# Altium project minna_pcb_project.PrjPCB
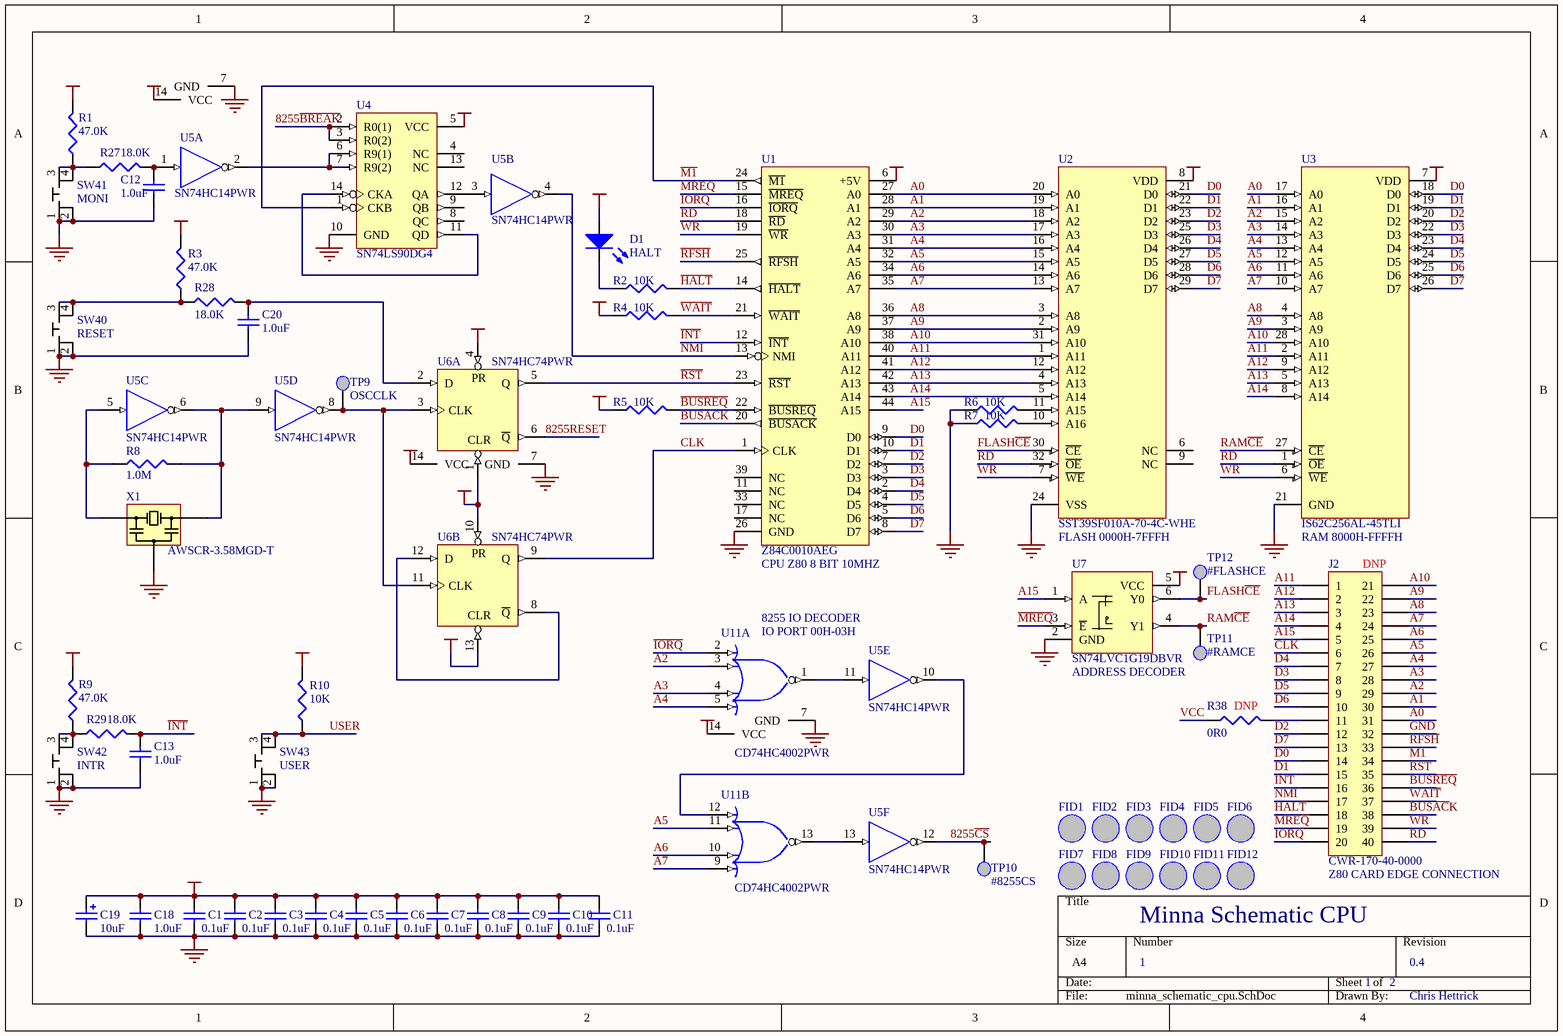
[diagram p0: minna_schematic_cpu.SchDoc]
ProjectTitle: smari minna; ProjectRevision: v0.4; ProjectAuthor: Chris Hettrick; CompanyName: Populate All The Resistors; CompanyEmail: info@populatealltheresistors.com
2 sheets, 145 parts. Net scope: global (net labels, ports and power ports of the same name join across sheets).
Board file: minna_pcb.PcbDoc
Sheets:
  minna_schematic_cpu.SchDoc
  minna_schematic_io.SchDoc

## Sheet minna_schematic_cpu.SchDoc: Minna Schematic CPU
size A4; Author: Chris Hettrick; CompanyName: Populate All The Resistors; DrawnBy: Chris Hettrick; Engineer: Chris Hettrick; Organization: Populate All The Resistors; DocumentNumber: 1; Revision: 0.4; SheetNumber: 1; SheetTotal: 2; DocumentName: minna_schematic_cpu.SchDoc; ProjectName: smari

### Parts
C1  0.1uF  [0603]
C2  0.1uF  [0603]
C3  0.1uF  [0603]
C4  0.1uF  [0603]
C5  0.1uF  [0603]
C6  0.1uF  [0603]
C7  0.1uF  [0603]
C8  0.1uF  [0603]
C9  0.1uF  [0603]
C10  0.1uF  [0603]
C11  0.1uF  [0603]
C12  1.0uF  [0805]
C13  1.0uF  [0805]
C18  1.0uF  [0805]
C19  10uF  [T491A]
C20  1.0uF  [0805]
D1  HALT  [APG1608]
FID1  FIDUCIAL  [Fiducial]  (value not drawn)  (no BOM)
FID2  FIDUCIAL  [Fiducial]  (value not drawn)  (no BOM)
FID3  FIDUCIAL  [Fiducial]  (value not drawn)  (no BOM)
FID4  FIDUCIAL  [Fiducial]  (value not drawn)  (no BOM)
FID5  FIDUCIAL  [Fiducial]  (value not drawn)  (no BOM)
FID6  FIDUCIAL  [Fiducial]  (value not drawn)  (no BOM)
FID7  FIDUCIAL  [Fiducial]  (value not drawn)  (no BOM)
FID8  FIDUCIAL  [Fiducial]  (value not drawn)  (no BOM)
FID9  FIDUCIAL  [Fiducial]  (value not drawn)  (no BOM)
FID10  FIDUCIAL  [Fiducial]  (value not drawn)  (no BOM)
FID11  FIDUCIAL  [Fiducial]  (value not drawn)  (no BOM)
FID12  FIDUCIAL  [Fiducial]  (value not drawn)  (no BOM)
J2  CWR-170-40-0000  Load: DNP  Notes: Z80 CARD EDGE CONNECTION  [CARD EDGE 40 PIN]
R1  47.0K  [0603]
R2  10K  [0603]
R3  47.0K  [0603]
R4  10K  [0603]
R5  10K  [0603]
R6  10K  [0603]
R7  10K  [0603]
R8  1.0M  [0603]
R9  47.0K  [0603]
R10  10K  [0603]
R27  18.0K  [0603]
R28  18.0K  [0603]
R29  18.0K  [0603]
R38  0R0  Load: DNP  [0603]
SW40  RESET  [PTS645SM43SMTR LFS]
SW41  MONI  [PTS645SM43SMTR LFS]
SW42  INTR  [PTS645SM43SMTR LFS]
SW43  USER  [PTS645SM43SMTR LFS]
TP9  OSCCLK  [TP_ICT]  (no BOM)
TP10  #8255CS  [TP_ICT]  (no BOM)
TP11  #RAMCE  [TP_ICT]  (no BOM)
TP12  #FLASHCE  [TP_ICT]  (no BOM)
U1  Z84C0010AEG  Notes: CPU Z80 8 BIT 10MHZ  [LQFP-44]
U2  SST39SF010A-70-4C-WHE  Notes: FLASH 0000H-7FFFH  [SST39SF010A-70-4C-WHE]
U3  IS62C256AL-45TLI  Notes: RAM 8000H-FFFFH  [IS62C256AL-45TLI]
U4  SN74LS90DG4  [DO14]
U5  SN74HC14PWR  [PW014]  (parts A,B,C,D,E,F of 6)
U6  SN74HC74PWR  [PW014]  (parts A,B of 2)
U7  SN74LVC1G19DBVR  Notes: ADDRESS DECODER  [SOT-23-6 DBV R-PDSO-G6]
U11  CD74HC4002PWR  [PW014]  (parts A,B of 2)
X1  AWSCR-3.58MGD-T  [AWSCR-MG]

### Nets
GND: C1.1 C2.1 C3.1 C4.1 C5.1 C6.1 C7.1 C8.1 C9.1 C10.1 C11.1 C12.1 C13.1 C18.2 C19.2 C20.1 J2.32 R6.1 R7.1 SW40.1 SW40.2 SW41.1 SW41.2 SW42.1 SW42.2 SW43.1 SW43.2 U1.26(GND) U2.24(VSS) U3.21(GND) U4.10(GND) U5.7(GND) U6.7(GND) U7.2(GND) U11.7(GND) X1.2
VCC: C1.2 C2.2 C3.2 C4.2 C5.2 C6.2 C7.2 C8.2 C9.2 C10.2 C11.2 C18.1 C19.1 D1.1(A) R1.2 R3.2 R4.1 R5.1 R9.2 R10.2 R38.1 U1.6(+5V) U2.8(VDD) U3.7(VDD) U4.5(VCC) U5.14(VCC) U6.1(CLR) U6.4(PR) U6.10(PR) U6.13(CLR) U6.14(VCC) U7.5(VCC) U11.14(VCC)
8255~{BREAK}: U4.2(R0(1)) U4.3(R0(2))
8255~{CS}: TP10.TP U5.12(~{Y})
8255RESET: U6.6(~{Q})
A0: J2.31 U1.27(A0) U2.20(A0) U3.17(A0)
A1: J2.30 U1.28(A1) U2.19(A1) U3.16(A1)
A2: J2.29 U1.29(A2) U2.18(A2) U3.15(A2) U11.3(B)
A3: J2.28 U1.30(A3) U2.17(A3) U3.14(A3) U11.4(C)
A4: J2.27 U1.31(A4) U2.16(A4) U3.13(A4) U11.5(D)
A5: J2.26 U1.32(A5) U2.15(A5) U3.12(A5) U11.11(B)
A6: J2.25 U1.34(A6) U2.14(A6) U3.11(A6) U11.10(C)
A7: J2.24 U1.35(A7) U2.13(A7) U3.10(A7) U11.9(D)
A8: J2.23 U1.36(A8) U2.3(A8) U3.4(A8)
A9: J2.22 U1.37(A9) U2.2(A9) U3.3(A9)
A10: J2.21 U1.38(A10) U2.31(A10) U3.28(A10)
A11: J2.1 U1.40(A11) U2.1(A11) U3.2(A11)
A12: J2.2 U1.41(A12) U2.12(A12) U3.9(A12)
A13: J2.3 U1.42(A13) U2.4(A13) U3.5(A13)
A14: J2.4 U1.43(A14) U2.5(A14) U3.8(A14)
A15: J2.5 U1.44(A15) U7.1(A)
~{BUSAC}K: J2.38 U1.20(~{BUSACK})
~{BUSREQ}: J2.36 R5.2 U1.22(~{BUSREQ})
CLK: J2.6 U1.1(CLK) U6.9(Q)
D0: J2.14 U1.9(D0) U2.21(D0) U3.18(D0)
D1: J2.15 U1.10(D1) U2.22(D1) U3.19(D1)
D2: J2.12 U1.7(D2) U2.23(D2) U3.20(D2)
D3: J2.8 U1.3(D3) U2.25(D3) U3.22(D3)
D4: J2.7 U1.2(D4) U2.26(D4) U3.23(D4)
D5: J2.9 U1.4(D5) U2.27(D5) U3.24(D5)
D6: J2.10 U1.5(D6) U2.28(D6) U3.25(D6)
D7: J2.13 U1.8(D7) U2.29(D7) U3.26(D7)
FLASH~{CE}: TP12.TP U2.30(~{CE}) U7.6(Y0)
~{HALT}: J2.18 R2.2 U1.14(~{HALT})
~{INT}: C13.2 J2.16 R29.2 U1.12(~{INT})
~{IORQ}: J2.20 U1.16(~{IORQ}) U11.2(A)
~{M1}: J2.34 U1.24(~{M1}) U4.1(CKB)
~{MREQ}: J2.19 U1.15(~{MREQ}) U7.3(~{E})
NMI: J2.17 U1.13(NMI) U5.4(~{Y})
~{RD}: J2.40 U1.18(~{RD}) U2.32(~{OE}) U3.1(~{OE})
~{RFSH}: J2.33 U1.25(~{RFSH})
~{RST}: J2.35 U1.23(~{RST}) U6.5(Q)
RAM~{CE}: TP11.TP U3.27(~{CE}) U7.4(Y1)
USER: R10.1 SW43.3 SW43.4
~{WAIT}: J2.37 R4.2 U1.21(~{WAIT})
~{WR}: J2.39 U1.19(~{WR}) U2.7(~{WE}) U3.6(~{WE})
NetC12_2: C12.2 R27.2 U5.1(A)
NetC20_2: C20.2 R28.2 U6.2(D)
NetD1_2: D1.2(K) R2.1
NetJ2_11: J2.11 R38.2
NetR1_1: R1.1 R27.1 SW41.3 SW41.4
NetR3_1: R3.1 R28.1 SW40.3 SW40.4
NetR6_2: R6.2 U2.11(A15)
NetR7_2: R7.2 U2.10(A16)
NetR8_1: R8.1 U5.5(A) X1.3
NetR8_2: R8.2 U5.6(~{Y}) U5.9(A) X1.1
NetR9_1: R9.1 R29.1 SW42.3 SW42.4
NetTP9_TP: TP9.TP U5.8(~{Y}) U6.3(CLK) U6.11(CLK)
NetU4_6: U4.6(R9(1)) U4.7(R9(2)) U5.2(~{Y})
NetU4_11: U4.11(QD) U4.14(CKA)
NetU4_12: U4.12(QA) U5.3(A)
NetU5_10: U5.10(~{Y}) U11.12(A)
NetU5_11: U5.11(A) U11.1(Y)
NetU5_13: U5.13(A) U11.13(Y)
NetU6_8: U6.8(~{Q}) U6.12(D)

Not connected (* = marked no-connect by the designer): U1 11(NC) 17(NC) 33(NC) 39(NC); U2 6(NC) 9(NC); U4 4(NC) 8(QC) 9(QB) 13(NC)

### Notes on the sheet
- (near U11) 8255 IO DECODER
- (near U11) IO PORT 00H-03H
- Title
- Size:
- Date:
- A4
- Number:
- Time:
- Revision:
- Sheet
- of
- File:

### Library data of the parts
C1-C11 = C0603: CAP .10UF 16V CERAMIC X7R 0603; Dist: Digikey; DistPN: 399-1096-1-ND; Load: yes; Mfgr: Kemet; MfgrPN: C0603C104K4RACTU; Polarized: no; Value: 0.1uF; Notes: *; Package: 0603
C12 C13 C18 C20 = C0805: CAP 1.0UF 16V CERAMIC X7R 0805; Dist: Digikey; DistPN: 399-1284-1-ND; Load: yes; Mfgr: Kemet; MfgrPN: C0805C105K4RACTU; Polarized: no; Value: 1.0uF; Package: 0805
  C13 C18: Notes: *
C19 = T491A: CAPACITOR TANT 10UF 10V 10% SMD; Dist: Digikey; DistPN: 399-3684-1-ND; Load: yes; Mfgr: Kemet; MfgrPN: T491A106K010AT; Value: 10uF; Notes: *; Package: 1206; Polarized: yes
D1 = LTST-C190KRKT: LED SUPER RED CLEAR 0603 SMD; Dist: Digikey; DistPN: 160-1436-2-ND; Load: yes; Mfgr: Lite-On; MfgrPN: LTST-C190KRKT; Package: 0603; Polarized: yes; Value: HALT
FID1-FID12 = FIDUCIAL: Load: DNP; Polarized: no; Dist: *; DistPN: *; Mfgr: *; MfgrPN: *; Notes: *; Value: FIDUCIAL; Package: *
J2 = CWR-170-40-0000: CONN CARD EDGE 40PIN GOLD; Dist: Digikey; DistPN: CCE40G-ND; Mfgr: CW Industries; Polarized: yes; MfgrPN: CWR-170-40-0000; Package: *; Value: CWR-170-40-0000
R1 R3 R9 = MCR03EZPFX: RES 47.0K OHM 1/10W 1% 0603 SMD; Dist: Digikey; DistPN: P47.0KHCT-ND; Mfgr: Panasonic; MfgrPN: ERJ-3EKF4702V; Load: yes; Polarized: no; Value: 47.0K; Package: 0603
R2 R4-R7 R10 = MCR03EZPFX: RES 10.0K OHM 1/10W 1% 0603 SMD; Dist: Digikey; DistPN: P10.0KHCT-ND; Mfgr: Panasonic; MfgrPN: ERJ-3EKF1002V; Load: yes; Polarized: no; Value: 10K; Package: 0603
R8 = MCR03EZPFX: RES 1.00M OHM 1/10W 1% 0603 SMD; Dist: Digikey; DistPN: P1.00MHCT-ND; Mfgr: Panasonic; MfgrPN: ERJ-3EKF1004V; Load: yes; Polarized: no; Value: 1.0M; Package: 0603
R27-R29 = MCR03EZPFX: RES 18.0K OHM 1/10W 1% 0603 SMD; Dist: Digikey; DistPN: P18.0KHCT-ND; Mfgr: Panasonic; MfgrPN: ERJ-3EKF1802V; Load: yes; Polarized: no; Value: 18.0K; Package: 0603
R38 = ERJ-3EKF1002V: RES 0.0 OHM 1/10W 0603 SMD; Dist: Digikey; DistPN: P0.0GCT-ND; Mfgr: Panasonic; MfgrPN: ERJ-3GEY0R00V; Notes: jumper; Polarized: no; Value: 0R0; Package: 0603
SW40-SW43 = PTS645SM43SMTR LFS: SWITCH TACT 6MM 160GF H=4.3MM; Dist: Digikey; DistPN: CKN9112CT-ND; Load: yes; Mfgr: C&K Components; MfgrPN: PTS645SM43SMTR LFS; Package: SMD-6x6; Polarized: yes
  SW40: Value: RESET
  SW41: Value: MONI
  SW42: Value: INTR
  SW43: Value: USER
TP9-TP12 = TP_ICT: TEST POINT; Load: DNP; Polarized: no
  TP9: Value: OSCCLK
  TP10: Value: #8255CS
  TP11: Value: #RAMCE
  TP12: Value: #FLASHCE
U1 = Z84C0010AEG: IC Z80 CPU CMOS 10MHZ 44LQFP; Dist: Digikey; DistPN: 269-4574-ND; Load: yes; Mfgr: Zilog; MfgrPN: Z84C0010AEG; Package: LQFP-44; Polarized: yes; Value: Z84C0010AEG
U2 = SST39SF010A-70-4C-WHE: IC FLASH MPF 1MBIT 70NS 32TSOP; Dist: Digikey; DistPN: SST39SF010A-70-4C-WHE-ND; Load: yes; Mfgr: SST; MfgrPN: SST39SF010A-70-4C-WHE; Package: TSOP-32; Polarized: yes; Value: SST39SF010A-70-4C-WHE
U3 = IS62C256AL-45TLI: IC SRAM 256KBIT 45NS 28TSOP; Dist: Digikey; DistPN: 706-1109-ND; Load: yes; Mfgr: ISSI; MfgrPN: IS62C256AL-45TLI; Package: TSOP-28; Polarized: yes; Value: IS62C256AL-45TLI
U4 = SN74LS90DG4: IC COUNTER DECADE 4BIT 14SOIC; Dist: Digikey; DistPN: 296-3746-5-ND; Load: yes; Mfgr: Texas Instruments; MfgrPN: SN74LS90DG4; Package: SOIC-14; Polarized: yes; Value: SN74LS90DG4
U5 = SN74HC14PWR: IC HEX SCHMITT-TRIG INV 14-TSSOP; Dist: Digikey; DistPN: 296-8234-1-ND; Load: yes; Mfgr: Texas Instruments; MfgrPN: SN74HC14PWR; Package: TSSOP-14; Polarized: yes; Value: SN74HC14PWR
U6 = SN74HC74PWR: IC DUAL F-F W/CLR/PRESET 14TSSOP; Dist: Digikey; DistPN: 296-8372-1-ND; Load: yes; Mfgr: Texas Instruments; MfgrPN: SN74HC74PWR; Package: TSSOP-14; Polarized: yes; Value: SN74HC74PWR
U7 = SN74LVC1G19DBVR: IC MUX/DECODER SNGL 1OF2 SOT23-6; Dist: Digikey; DistPN: 296-16982-1-ND; Load: yes; Mfgr: Texas Instruments; MfgrPN: SN74LVC1G19DBVR; Package: TSSOP-6; Polarized: yes; Value: SN74LVC1G19DBVR
U11 = CD74HC4002PWR: IC DUAL 4-IN NOR GATE 14TSSOP; Dist: Digikey; DistPN: 296-31585-1-ND; Load: yes; Mfgr: Texas Instruments; MfgrPN: CD74HC4002PWR; Notes: *; Package: TSSOP-14; Polarized: yes; Value: CD74HC4002PWR
X1 = AWSCR-3.58MGD-T: RESONATOR CER 3.58MHZ W/CAP SMD; Dist: Digikey; DistPN: 535-9365-1-ND; Load: yes; Mfgr: Abracon; Polarized: no; Value: AWSCR-3.58MGD-T; MfgrPN: AWSCR-3.58MGD-T; Package: SMD-7.4x3.4

## Sheet minna_schematic_io.SchDoc: Minna Schematic Input Output
size A4; Author: Chris Hettrick; CompanyName: Populate All The Resistors; DrawnBy: Chris Hettrick; Engineer: Chris Hettrick; Organization: Populate All The Resistors; DocumentNumber: 2; Revision: 0.4; SheetNumber: 2; SheetTotal: 2; DocumentName: minna_schematic_io.SchDoc; ProjectName: smari
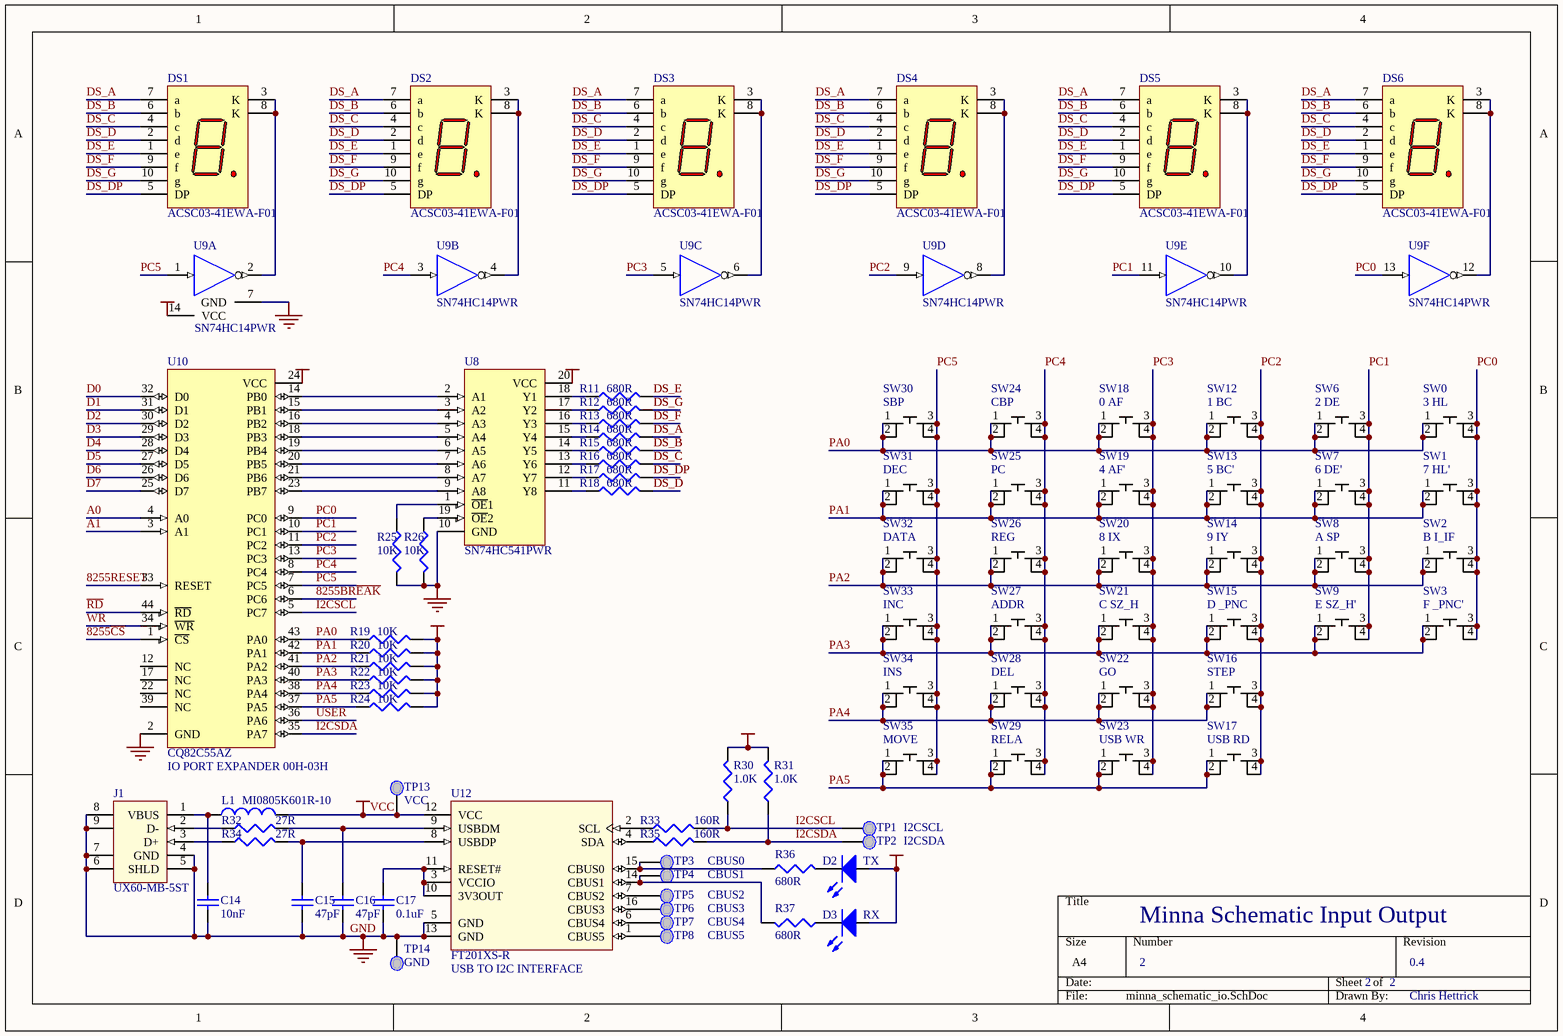
[diagram p1: minna_schematic_io.SchDoc]

### Parts
C14  10nF  [0603]
C15  47pF  [0603]
C16  47pF  [0603]
C17  0.1uF  [0603]
D2  TX  [APG1608]
D3  RX  [APG1608]
DS1  ACSC03-41EWA-F01  [ACSC03-41EWA-F01]
DS2  ACSC03-41EWA-F01  [ACSC03-41EWA-F01]
DS3  ACSC03-41EWA-F01  [ACSC03-41EWA-F01]
DS4  ACSC03-41EWA-F01  [ACSC03-41EWA-F01]
DS5  ACSC03-41EWA-F01  [ACSC03-41EWA-F01]
DS6  ACSC03-41EWA-F01  [ACSC03-41EWA-F01]
J1  UX60-MB-5ST  [UX60-MB-5ST]
L1  MI0805K601R-10  [0805]
R11  680R  [0603]
R12  680R  [0603]
R13  680R  [0603]
R14  680R  [0603]
R15  680R  [0603]
R16  680R  [0603]
R17  680R  [0603]
R18  680R  [0603]
R19  10K  [0603]
R20  10K  [0603]
R21  10K  [0603]
R22  10K  [0603]
R23  10K  [0603]
R24  10K  [0603]
R25  10K  [0603]
R26  10K  [0603]
R30  1.0K  [0603]
R31  1.0K  [0603]
R32  27R  [0603]
R33  160R  [0603]
R34  27R  [0603]
R35  160R  [0603]
R36  680R  [0603]
R37  680R  [0603]
SW0  3 HL  [PTS645SM43SMTR LFS]
SW1  7 HL'  [PTS645SM43SMTR LFS]
SW2  B I_IF  [PTS645SM43SMTR LFS]
SW3  F _PNC'  [PTS645SM43SMTR LFS]
SW6  2 DE  [PTS645SM43SMTR LFS]
SW7  6 DE'  [PTS645SM43SMTR LFS]
SW8  A SP  [PTS645SM43SMTR LFS]
SW9  E SZ_H'  [PTS645SM43SMTR LFS]
SW12  1 BC  [PTS645SM43SMTR LFS]
SW13  5 BC'  [PTS645SM43SMTR LFS]
SW14  9 IY  [PTS645SM43SMTR LFS]
SW15  D _PNC  [PTS645SM43SMTR LFS]
SW16  STEP  [PTS645SM43SMTR LFS]
SW17  USB RD  [PTS645SM43SMTR LFS]
SW18  0 AF  [PTS645SM43SMTR LFS]
SW19  4 AF'  [PTS645SM43SMTR LFS]
SW20  8 IX  [PTS645SM43SMTR LFS]
SW21  C SZ_H  [PTS645SM43SMTR LFS]
SW22  GO  [PTS645SM43SMTR LFS]
SW23  USB WR  [PTS645SM43SMTR LFS]
SW24  CBP  [PTS645SM43SMTR LFS]
SW25  PC  [PTS645SM43SMTR LFS]
SW26  REG  [PTS645SM43SMTR LFS]
SW27  ADDR  [PTS645SM43SMTR LFS]
SW28  DEL  [PTS645SM43SMTR LFS]
SW29  RELA  [PTS645SM43SMTR LFS]
SW30  SBP  [PTS645SM43SMTR LFS]
SW31  DEC  [PTS645SM43SMTR LFS]
SW32  DATA  [PTS645SM43SMTR LFS]
SW33  INC  [PTS645SM43SMTR LFS]
SW34  INS  [PTS645SM43SMTR LFS]
SW35  MOVE  [PTS645SM43SMTR LFS]
TP1  I2CSCL  [TP_ICT]  (no BOM)
TP2  I2CSDA  [TP_ICT]  (no BOM)
TP3  CBUS0  [TP_ICT]  (no BOM)
TP4  CBUS1  [TP_ICT]  (no BOM)
TP5  CBUS2  [TP_ICT]  (no BOM)
TP6  CBUS3  [TP_ICT]  (no BOM)
TP7  CBUS4  [TP_ICT]  (no BOM)
TP8  CBUS5  [TP_ICT]  (no BOM)
TP13  VCC  [TP_ICT]  (no BOM)
TP14  GND  [TP_ICT]  (no BOM)
U8  SN74HC541PWR  [PW020]
U9  SN74HC14PWR  [PW014]  (parts A,B,C,D,E,F of 6)
U10  CQ82C55AZ  Notes: IO PORT EXPANDER 00H-03H  [MQFP-44]
U12  FT201XS-R  Notes: USB TO I2C INTERFACE  [SSOP-16]

### Nets
GND: C14.2 C15.2 C16.2 C17.1 J1.4(GND) J1.5(SHLD) J1.6(SHLD) J1.7(SHLD) J1.8(SHLD) J1.9(SHLD) R25.2 R26.2 TP14.TP U8.10(GND) U9.7(GND) U10.2(GND) U12.5(GND) U12.13(GND)
VCC: D2.1(A) D3.1(A) L1.2 R19.2 R20.2 R21.2 R22.2 R23.2 R24.2 R30.2 R31.2 TP13.TP U8.20(VCC) U9.14(VCC) U10.24(VCC) U12.12(VCC)
8255~{BREAK}: U10.6(PC6)
8255~{CS}: U10.1(~{CS})
8255RESET: U10.33(RESET)
A0: U10.4(A0)
A1: U10.3(A1)
D0: U10.32(D0)
D1: U10.31(D1)
D2: U10.30(D2)
D3: U10.29(D3)
D4: U10.28(D4)
D5: U10.27(D5)
D6: U10.26(D6)
D7: U10.25(D7)
DS_A: DS1.7(a) DS2.7(a) DS3.7(a) DS4.7(a) DS5.7(a) DS6.7(a) R14.2
DS_B: DS1.6(b) DS2.6(b) DS3.6(b) DS4.6(b) DS5.6(b) DS6.6(b) R15.2
DS_C: DS1.4(c) DS2.4(c) DS3.4(c) DS4.4(c) DS5.4(c) DS6.4(c) R16.2
DS_D: DS1.2(d) DS2.2(d) DS3.2(d) DS4.2(d) DS5.2(d) DS6.2(d) R18.2
DS_DP: DS1.5(DP) DS2.5(DP) DS3.5(DP) DS4.5(DP) DS5.5(DP) DS6.5(DP) R17.2
DS_E: DS1.1(e) DS2.1(e) DS3.1(e) DS4.1(e) DS5.1(e) DS6.1(e) R11.2
DS_F: DS1.9(f) DS2.9(f) DS3.9(f) DS4.9(f) DS5.9(f) DS6.9(f) R13.2
DS_G: DS1.10(g) DS2.10(g) DS3.10(g) DS4.10(g) DS5.10(g) DS6.10(g) R12.2
I2CSCL: R30.1 R33.2 TP1.TP U10.5(PC7)
I2CSDA: R31.1 R35.2 TP2.TP U10.35(PA7)
PA0: R19.1 SW0.1 SW0.2 SW6.1 SW6.2 SW12.1 SW12.2 SW18.1 SW18.2 SW24.1 SW24.2 SW30.1 SW30.2 U10.43(PA0)
PA1: R20.1 SW1.1 SW1.2 SW7.1 SW7.2 SW13.1 SW13.2 SW19.1 SW19.2 SW25.1 SW25.2 SW31.1 SW31.2 U10.42(PA1)
PA2: R21.1 SW2.1 SW2.2 SW8.1 SW8.2 SW14.1 SW14.2 SW20.1 SW20.2 SW26.1 SW26.2 SW32.1 SW32.2 U10.41(PA2)
PA3: R22.1 SW3.1 SW3.2 SW9.1 SW9.2 SW15.1 SW15.2 SW21.1 SW21.2 SW27.1 SW27.2 SW33.1 SW33.2 U10.40(PA3)
PA4: R23.1 SW16.1 SW16.2 SW22.1 SW22.2 SW28.1 SW28.2 SW34.1 SW34.2 U10.38(PA4)
PA5: R24.1 SW17.1 SW17.2 SW23.1 SW23.2 SW29.1 SW29.2 SW35.1 SW35.2 U10.37(PA5)
PC0: SW0.3 SW0.4 SW1.3 SW1.4 SW2.3 SW2.4 SW3.3 SW3.4 U9.13(A) U10.9(PC0)
PC1: SW6.3 SW6.4 SW7.3 SW7.4 SW8.3 SW8.4 SW9.3 SW9.4 U9.11(A) U10.10(PC1)
PC2: SW12.3 SW12.4 SW13.3 SW13.4 SW14.3 SW14.4 SW15.3 SW15.4 SW16.3 SW16.4 SW17.3 SW17.4 U9.9(A) U10.11(PC2)
PC3: SW18.3 SW18.4 SW19.3 SW19.4 SW20.3 SW20.4 SW21.3 SW21.4 SW22.3 SW22.4 SW23.3 SW23.4 U9.5(A) U10.13(PC3)
PC4: SW24.3 SW24.4 SW25.3 SW25.4 SW26.3 SW26.4 SW27.3 SW27.4 SW28.3 SW28.4 SW29.3 SW29.4 U9.3(A) U10.8(PC4)
PC5: SW30.3 SW30.4 SW31.3 SW31.4 SW32.3 SW32.4 SW33.3 SW33.4 SW34.3 SW34.4 SW35.3 SW35.4 U9.1(A) U10.7(PC5)
~{RD}: U10.44(~{RD})
USER: U10.36(PA6)
~{WR}: U10.34(~{WR})
NetC14_1: C14.1 J1.1(VBUS) L1.1
NetC15_1: C15.1 R34.2 U12.8(USBDP)
NetC16_1: C16.1 R32.2 U12.9(USBDM)
NetC17_2: C17.2 U12.3(VCCIO) U12.10(3V3OUT) U12.11(RESET#)
NetD2_2: D2.2(K) R36.2
NetD3_2: D3.2(K) R37.1
NetDS1_3: DS1.3(K) DS1.8(K) U9.2(~{Y})
NetDS2_3: DS2.3(K) DS2.8(K) U9.4(~{Y})
NetDS3_3: DS3.3(K) DS3.8(K) U9.6(~{Y})
NetDS4_3: DS4.3(K) DS4.8(K) U9.8(~{Y})
NetDS5_3: DS5.3(K) DS5.8(K) U9.10(~{Y})
NetDS6_3: DS6.3(K) DS6.8(K) U9.12(~{Y})
NetJ1_2: J1.2(D-) R32.1
NetJ1_3: J1.3(D+) R34.1
NetR11_1: R11.1 U8.18(Y1)
NetR12_1: R12.1 U8.17(Y2)
NetR13_1: R13.1 U8.16(Y3)
NetR14_1: R14.1 U8.15(Y4)
NetR15_1: R15.1 U8.14(Y5)
NetR16_1: R16.1 U8.13(Y6)
NetR17_1: R17.1 U8.12(Y7)
NetR18_1: R18.1 U8.11(Y8)
NetR25_1: R25.1 U8.1(~{OE}1)
NetR26_1: R26.1 U8.19(~{OE}2)
NetR33_1: R33.1 U12.2(SCL)
NetR35_1: R35.1 U12.4(SDA)
NetR36_1: R36.1 TP3.TP U12.15(CBUS0)
NetR37_2: R37.2 TP4.TP U12.14(CBUS1)
NetTP5_TP: TP5.TP U12.7(CBUS2)
NetTP6_TP: TP6.TP U12.16(CBUS3)
NetTP7_TP: TP7.TP U12.6(CBUS4)
NetTP8_TP: TP8.TP U12.1(CBUS5)
NetU8_2: U8.2(A1) U10.14(PB0)
NetU8_3: U8.3(A2) U10.15(PB1)
NetU8_4: U8.4(A3) U10.16(PB2)
NetU8_5: U8.5(A4) U10.18(PB3)
NetU8_6: U8.6(A5) U10.19(PB4)
NetU8_7: U8.7(A6) U10.20(PB5)
NetU8_8: U8.8(A7) U10.21(PB6)
NetU8_9: U8.9(A8) U10.23(PB7)

Not connected (* = marked no-connect by the designer): U10 12(NC) 17(NC) 22(NC) 39(NC)

### Notes on the sheet
- Title
- Size:
- Date:
- A4
- Number:
- Time:
- Revision:
- Sheet
- of
- File:

### Library data of the parts
C14 = C0603: CAP CER 10000PF 50V 10% X7R 0603; Dist: Digikey; DistPN: 399-1091-1-ND; Load: yes; Mfgr: Kemet; MfgrPN: C0603C103K5RACTU; Polarized: no; Value: 10nF; Notes: *; Package: 0603
C15 C16 = C0603: CAP CER 47PF 50V 5% NP0 0603; Dist: Digikey; DistPN: 399-1056-1-ND; Load: yes; Mfgr: Kemet; MfgrPN: C0603C470J5GACTU; Polarized: no; Value: 47pF; Notes: *; Package: 0603
C17 = C0603: as C1 on sheet minna_schematic_cpu; Value: 0.1uF; Notes: *; Package: 0603
D2 D3 = LTST-C190KRKT: as D1 on sheet minna_schematic_cpu; MfgrPN: LTST-C190KRKT; Package: 0603; Polarized: yes
  D2: Value: TX
  D3: Value: RX
DS1-DS6 = ACSC03-41EWA-F01: DISPLAY 0.3" 627NM SGL RED SMD; Dist: Digikey; DistPN: 754-1037-1-ND; Load: yes; Mfgr: Kingbright Corp; MfgrPN: ACSC03-41EWA-F01; Package: SMD-10; Polarized: yes; Value: ACSC03-41EWA-F01
J1 = UX60-MB-5ST: CONN RECEPT MINI USB2.0 5POS; Load: yes; Dist: Digikey; Mfgr: Hirose; DistPN: H2959CT-ND; Value: UX60-MB-5ST; Polarized: yes; Notes: *; MfgrPN: UX60-MB-5ST; Package: USB Mini B 5 Pin Receptacle
L1 = MI0805K601R-10: FERRITE CHIP POWER 600 OHM SMD; Load: yes; Dist: Digikey; Mfgr: Laird; DistPN: 240-2390-1-ND; Polarized: no; Value: MI0805K601R-10; Package: 0805; MfgrPN: MI0805K601R-10
R11-R18 R36 R37 = MCR03EZPFX: RES 680 OHM 1/10W 1% 0603 SMD; Dist: Digikey; DistPN: P680HCT-ND; Mfgr: Panasonic; MfgrPN: ERJ-3EKF6800V; Load: yes; Polarized: no; Value: 680R; Package: 0603
R19-R26 = MCR03EZPFX: as R2 on sheet minna_schematic_cpu; Value: 10K; Package: 0603
R30 R31 = ERJ-3EKF1002V: RES 1.00K OHM 1/10W 1% 0603 SMD; Dist: Digikey; DistPN: P1.00KHCT-ND; Mfgr: Panasonic; MfgrPN: ERJ-3EKF1001V; Load: yes; Polarized: no; Value: 1.0K; Package: 0603
R32 R34 = ERJ-3EKF1002V: RES 27.0 OHM 1/10W 1% 0603 SMD; Dist: Digikey; DistPN: P27.0HCT-ND; Mfgr: Panasonic; MfgrPN: ERJ-3EKF27R0V; Load: yes; Polarized: no; Value: 27R; Package: 0603
R33 R35 = ERJ-3EKF1002V: RES 160 OHM 1/10W 1% 0603 SMD; Dist: Digikey; DistPN: P160HCT-ND; Mfgr: Panasonic; MfgrPN: ERJ-3EKF1600V; Load: yes; Polarized: no; Value: 160R; Package: 0603
SW0-SW3 SW6-SW9 SW12-SW35 = PTS645SM43SMTR LFS: as SW40 on sheet minna_schematic_cpu; MfgrPN: PTS645SM43SMTR LFS; Package: SMD-6x6; Polarized: yes
  SW0: Value: 3 HL
  SW1: Value: 7 HL'
  SW2: Value: B I_IF
  SW3: Value: F _PNC'
  SW6: Value: 2 DE
  SW7: Value: 6 DE'
  SW8: Value: A SP
  SW9: Value: E SZ_H'
  SW12: Value: 1 BC
  SW13: Value: 5 BC'
  SW14: Value: 9 IY
  SW15: Value: D _PNC
  SW16: Value: STEP
  SW17: Value: USB RD
  SW18: Value: 0 AF
  SW19: Value: 4 AF'
  SW20: Value: 8 IX
  SW21: Value: C SZ_H
  SW22: Value: GO
  SW23: Value: USB WR
  SW24: Value: CBP
  SW25: Value: PC
  SW26: Value: REG
  SW27: Value: ADDR
  SW28: Value: DEL
  SW29: Value: RELA
  SW30: Value: SBP
  SW31: Value: DEC
  SW32: Value: DATA
  SW33: Value: INC
  SW34: Value: INS
  SW35: Value: MOVE
TP1-TP8 TP13 TP14 = TP_ICT: TEST POINT; Load: DNP; Polarized: no
  TP1: Value: I2CSCL
  TP2: Value: I2CSDA
  TP3: Value: CBUS0
  TP4: Value: CBUS1
  TP5: Value: CBUS2
  TP6: Value: CBUS3
  TP7: Value: CBUS4
  TP8: Value: CBUS5
  TP13: Value: VCC
  TP14: Value: GND
U8 = SN74HC541PWR: IC BUFF/DVR TRI-ST 8BIT 20TSSOP; Dist: Digikey; DistPN: 296-8335-1-ND; Load: yes; Mfgr: Texas Instruments; MfgrPN: SN74HC541PWR; Package: TSSOP-20; Polarized: yes; Value: SN74HC541PWR
U9 = SN74HC14PWR: as U5 on sheet minna_schematic_cpu; MfgrPN: SN74HC14PWR; Package: TSSOP-14; Polarized: yes; Value: SN74HC14PWR
U10 = CMQ82C55AZ: IC I/O EXPANDER 24B 44MQFP; Dist: Digikey; DistPN: CQ82C55AZ-ND; Load: yes; Mfgr: Intersil; MfgrPN: CQ82C55AZ; Package: MQFP-44; Polarized: yes; Value: CQ82C55AZ
U12 = FT201XS-R: IC USB FS I2C SSOP-16; Mfgr: FTDI; Load: yes; Dist: Digikey; DistPN: 768-1136-1-ND; MfgrPN: FT201XS-R; Package: SSOP-16; Polarized: yes; Value: FT201XS-R

## Nets that join several sheets
GND: minna_schematic_cpu (36 pins), minna_schematic_io (18 pins)
VCC: minna_schematic_cpu (33 pins), minna_schematic_io (16 pins)
8255~{BREAK}: minna_schematic_cpu (U4.2 U4.3), minna_schematic_io (U10.6)
8255~{CS}: minna_schematic_cpu (TP10.TP U5.12), minna_schematic_io (U10.1)
8255RESET: minna_schematic_cpu (U6.6), minna_schematic_io (U10.33)
A0: minna_schematic_cpu (J2.31 U1.27 U2.20 U3.17), minna_schematic_io (U10.4)
A1: minna_schematic_cpu (J2.30 U1.28 U2.19 U3.16), minna_schematic_io (U10.3)
D0: minna_schematic_cpu (J2.14 U1.9 U2.21 U3.18), minna_schematic_io (U10.32)
D1: minna_schematic_cpu (J2.15 U1.10 U2.22 U3.19), minna_schematic_io (U10.31)
D2: minna_schematic_cpu (J2.12 U1.7 U2.23 U3.20), minna_schematic_io (U10.30)
D3: minna_schematic_cpu (J2.8 U1.3 U2.25 U3.22), minna_schematic_io (U10.29)
D4: minna_schematic_cpu (J2.7 U1.2 U2.26 U3.23), minna_schematic_io (U10.28)
D5: minna_schematic_cpu (J2.9 U1.4 U2.27 U3.24), minna_schematic_io (U10.27)
D6: minna_schematic_cpu (J2.10 U1.5 U2.28 U3.25), minna_schematic_io (U10.26)
D7: minna_schematic_cpu (J2.13 U1.8 U2.29 U3.26), minna_schematic_io (U10.25)
~{RD}: minna_schematic_cpu (J2.40 U1.18 U2.32 U3.1), minna_schematic_io (U10.44)
USER: minna_schematic_cpu (R10.1 SW43.3 SW43.4), minna_schematic_io (U10.36)
~{WR}: minna_schematic_cpu (J2.39 U1.19 U2.7 U3.6), minna_schematic_io (U10.34)